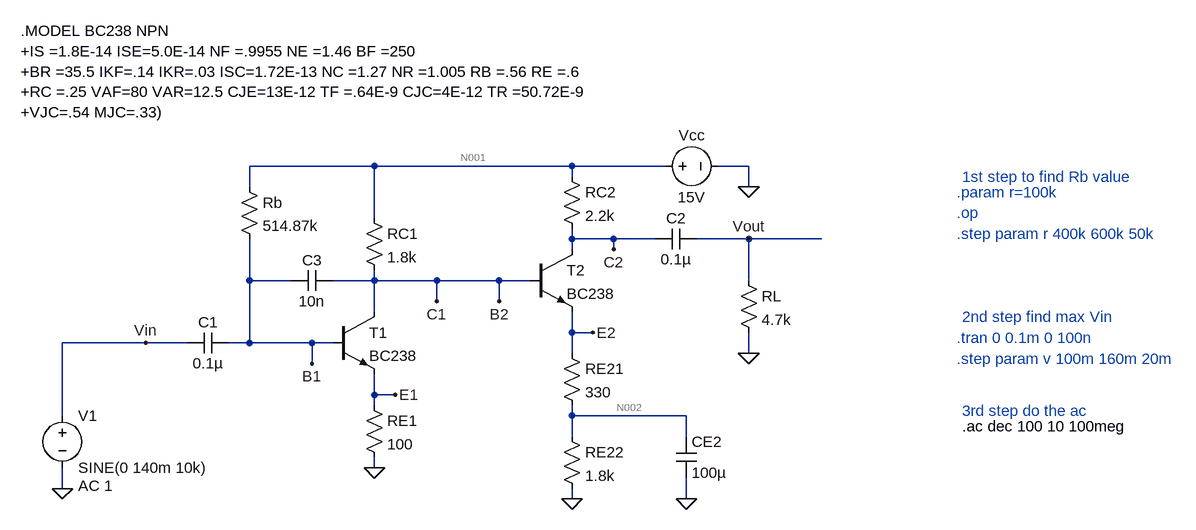
[diagram p0: schematic Ask3, se seira (me piknoti).asc]
Ask3, se seira (me piknoti).asc, the LTspice schematic file:
Version 4.1
SHEET 1 1776 680
WIRE 512 -208 320 -208
WIRE 816 -208 512 -208
WIRE 960 -208 816 -208
WIRE 1088 -208 1040 -208
WIRE 816 -192 816 -208
WIRE 320 -176 320 -208
WIRE 1088 -176 1088 -208
WIRE 512 -128 512 -208
WIRE 816 -96 816 -112
WIRE 880 -96 816 -96
WIRE 944 -96 880 -96
WIRE 1088 -96 1008 -96
WIRE 1200 -96 1088 -96
WIRE 816 -80 816 -96
WIRE 880 -80 880 -96
WIRE 320 -32 320 -96
WIRE 384 -32 320 -32
WIRE 512 -32 512 -48
WIRE 512 -32 448 -32
WIRE 608 -32 512 -32
WIRE 704 -32 608 -32
WIRE 752 -32 704 -32
WIRE 1088 -32 1088 -96
WIRE 608 0 608 -32
WIRE 704 0 704 -32
WIRE 512 16 512 -32
WIRE 816 48 816 16
WIRE 848 48 816 48
WIRE 160 64 32 64
WIRE 224 64 160 64
WIRE 320 64 320 -32
WIRE 320 64 288 64
WIRE 416 64 320 64
WIRE 448 64 416 64
WIRE 816 80 816 48
WIRE 1088 80 1088 48
WIRE 416 96 416 64
WIRE 512 144 512 112
WIRE 544 144 512 144
WIRE 512 160 512 144
WIRE 32 176 32 64
WIRE 816 176 816 160
WIRE 992 176 816 176
WIRE 816 208 816 176
WIRE 992 208 992 176
WIRE 512 256 512 240
WIRE 32 288 32 256
WIRE 816 304 816 288
WIRE 992 304 992 272
FLAG 32 288 0
FLAG 1088 80 0
FLAG 512 256 0
FLAG 1088 -96 Vout
FLAG 1088 -176 0
FLAG 816 304 0
FLAG 160 64 Vin
FLAG 608 0 C1
FLAG 416 96 B1
FLAG 544 144 E1
FLAG 704 0 B2
FLAG 848 48 E2
FLAG 880 -80 C2
FLAG 992 304 0
SYMBOL voltage 32 160 R0
WINDOW 123 24 124 Left 2
WINDOW 39 0 0 Left 0
SYMATTR Value2 AC 1
SYMATTR InstName V1
SYMATTR Value SINE(0 140m 10k)
SYMBOL res 496 -144 R0
SYMATTR InstName RC1
SYMATTR Value 1.8k
SYMBOL cap 1008 -112 R90
WINDOW 0 0 32 VBottom 2
WINDOW 3 32 32 VTop 2
SYMATTR InstName C2
SYMATTR Value 0.1µ
SYMBOL res 1072 -48 R0
SYMATTR InstName RL
SYMATTR Value 4.7k
SYMBOL cap 288 48 R90
WINDOW 0 0 32 VBottom 2
WINDOW 3 32 32 VTop 2
SYMATTR InstName C1
SYMATTR Value 0.1µ
SYMBOL res 800 64 R0
SYMATTR InstName RE21
SYMATTR Value 330
SYMBOL res 496 144 R0
SYMATTR InstName RE1
SYMATTR Value 100
SYMBOL npn 448 16 R0
SYMATTR InstName T1
SYMATTR Value BC238
SYMBOL npn 752 -80 R0
SYMATTR InstName T2
SYMATTR Value BC238
SYMBOL res 800 -208 R0
SYMATTR InstName RC2
SYMATTR Value 2.2k
SYMBOL voltage 944 -208 R270
WINDOW 0 32 56 VTop 2
WINDOW 3 -32 56 VBottom 2
SYMATTR InstName Vcc
SYMATTR Value 15V
SYMBOL res 800 192 R0
SYMATTR InstName RE22
SYMATTR Value 1.8k
SYMBOL cap 448 -48 R90
WINDOW 0 0 32 VBottom 2
WINDOW 3 32 32 VTop 2
SYMATTR InstName C3
SYMATTR Value 10n
SYMBOL res 304 -192 R0
SYMATTR InstName Rb
SYMATTR Value 514.87k
SYMBOL cap 976 208 R0
SYMATTR InstName CE2
SYMATTR Value 100µ
TEXT -32 -416 Left 2 !.MODEL BC238 NPN\n+IS =1.8E-14 ISE=5.0E-14 NF =.9955 NE =1.46 BF =250\n+BR =35.5 IKF=.14 IKR=.03 ISC=1.72E-13 NC =1.27 NR =1.005 RB =.56 RE =.6\n+RC =.25 VAF=80 VAR=12.5 CJE=13E-12 TF =.64E-9 CJC=4E-12 TR =50.72E-9\n+VJC=.54 MJC=.33)
TEXT 1416 192 Left 2 !.ac dec 100 10 100meg
TEXT 1408 -168 Left 2 ;.param r=100k
TEXT 1408 -104 Left 2 ;.step param r 400k 600k 50k
TEXT 1416 -192 Left 2 ;1st step to find Rb value
TEXT 1408 -136 Left 2 ;.op
TEXT 1408 56 Left 2 ;.tran 0 0.1m 0 100n
TEXT 1408 88 Left 2 ;.step param v 100m 160m 20m
TEXT 1416 24 Left 2 ;2nd step find max Vin
TEXT 1416 168 Left 2 ;3rd step do the ac

The netlist it stands for:
* Ask3, se seira (me piknoti).asc
V1 Vin 0 SINE(0 140m 10k) AC 1
RC1 N001 B2 1.8k
C2 Vout C2 0.1µ
RL Vout 0 4.7k
C1 B1 Vin 0.1µ
RE21 E2 N002 330
RE1 E1 0 100
Q§T1 B2 B1 E1 0 BC238
Q§T2 C2 B2 E2 0 BC238
RC2 N001 C2 2.2k
Vcc N001 0 15V
RE22 N002 0 1.8k
C3 B2 B1 10n
Rb N001 B1 514.87k
CE2 N002 0 100µ
.model NPN NPN
.model PNP PNP
.lib standard.bjt
.MODEL BC238 NPN
+IS =1.8E-14 ISE=5.0E-14 NF =.9955 NE =1.46 BF =250
+BR =35.5 IKF=.14 IKR=.03 ISC=1.72E-13 NC =1.27 NR =1.005 RB =.56 RE =.6
+RC =.25 VAF=80 VAR=12.5 CJE=13E-12 TF =.64E-9 CJC=4E-12 TR =50.72E-9
+VJC=.54 MJC=.33)
.ac dec 100 10 100meg
* .param r=100k
* .step param r 400k 600k 50k
* 1st step to find Rb value
* .op
* .tran 0 0.1m 0 100n
* .step param v 100m 160m 20m
* 2nd step find max Vin
* 3rd step do the ac
.backanno
.end

* Results of the author's LTspice run, read from the files saved beside the schematic
* Operating Point, zero values left out:
*   V(b1) = 1.242 V
*   V(b2) = 5.014 V
*   V(c2) = 10.52 V
*   V(e1) = 556.4 mV
*   V(e2) = 4.358 V
*   V(n001) = 15 V
*   V(n002) = 3.683 V
*   I(RC1) = 5.548 mA
*   I(RC2) = 2.036 mA
*   I(RE1) = 5.564 mA
*   I(RE21) = 2.046 mA
*   I(RE22) = 2.046 mA
*   I(Rb) = 26.72 µA
*   I(Vcc) = -7.61 mA
*   Ib(T1) = 26.72 µA
*   Ib(T2) = 9.846 µA
*   Ic(T1) = 5.538 mA
*   Ic(T2) = 2.036 mA
*   Ie(T1) = -5.564 mA
*   Ie(T2) = -2.046 mA
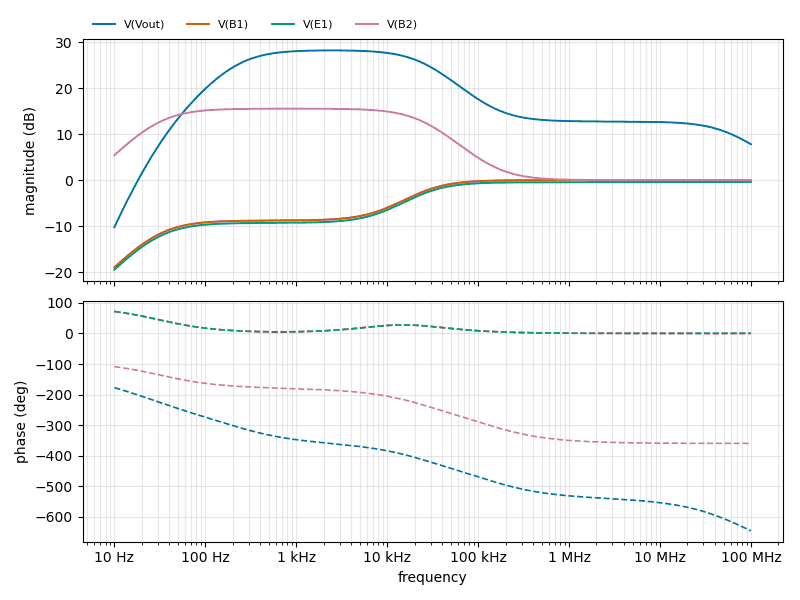
[diagram p1: AC Analysis of Ask3, se seira (me piknoti).asc, plotted from the saved traces]
* AC Analysis, 1 run:
*   V(Vout): -10.25 dB at 10 Hz, 7.81 dB at 100 MHz, peak 28.20 dB at 2.455 kHz, 3 dB below the peak at 230.8 Hz and 26.28 kHz
*   V(B1): -18.97 dB at 10 Hz, -0.00 dB at 100 MHz, peak -0.00 dB at 100 MHz, 3 dB below the peak at 21.5 kHz
*   V(E1): -19.48 dB at 10 Hz, -0.40 dB at 100 MHz, peak -0.40 dB at 100 MHz, 3 dB below the peak at 21.91 kHz
*   V(B2): 5.40 dB at 10 Hz, 0.00 dB at 100 MHz, peak 15.53 dB at 891.3 Hz, 3 dB below the peak at 30.58 Hz and 25.86 kHz